# EAGLE design MDM_V3_ControlBoard_A (EAGLE 6.4)
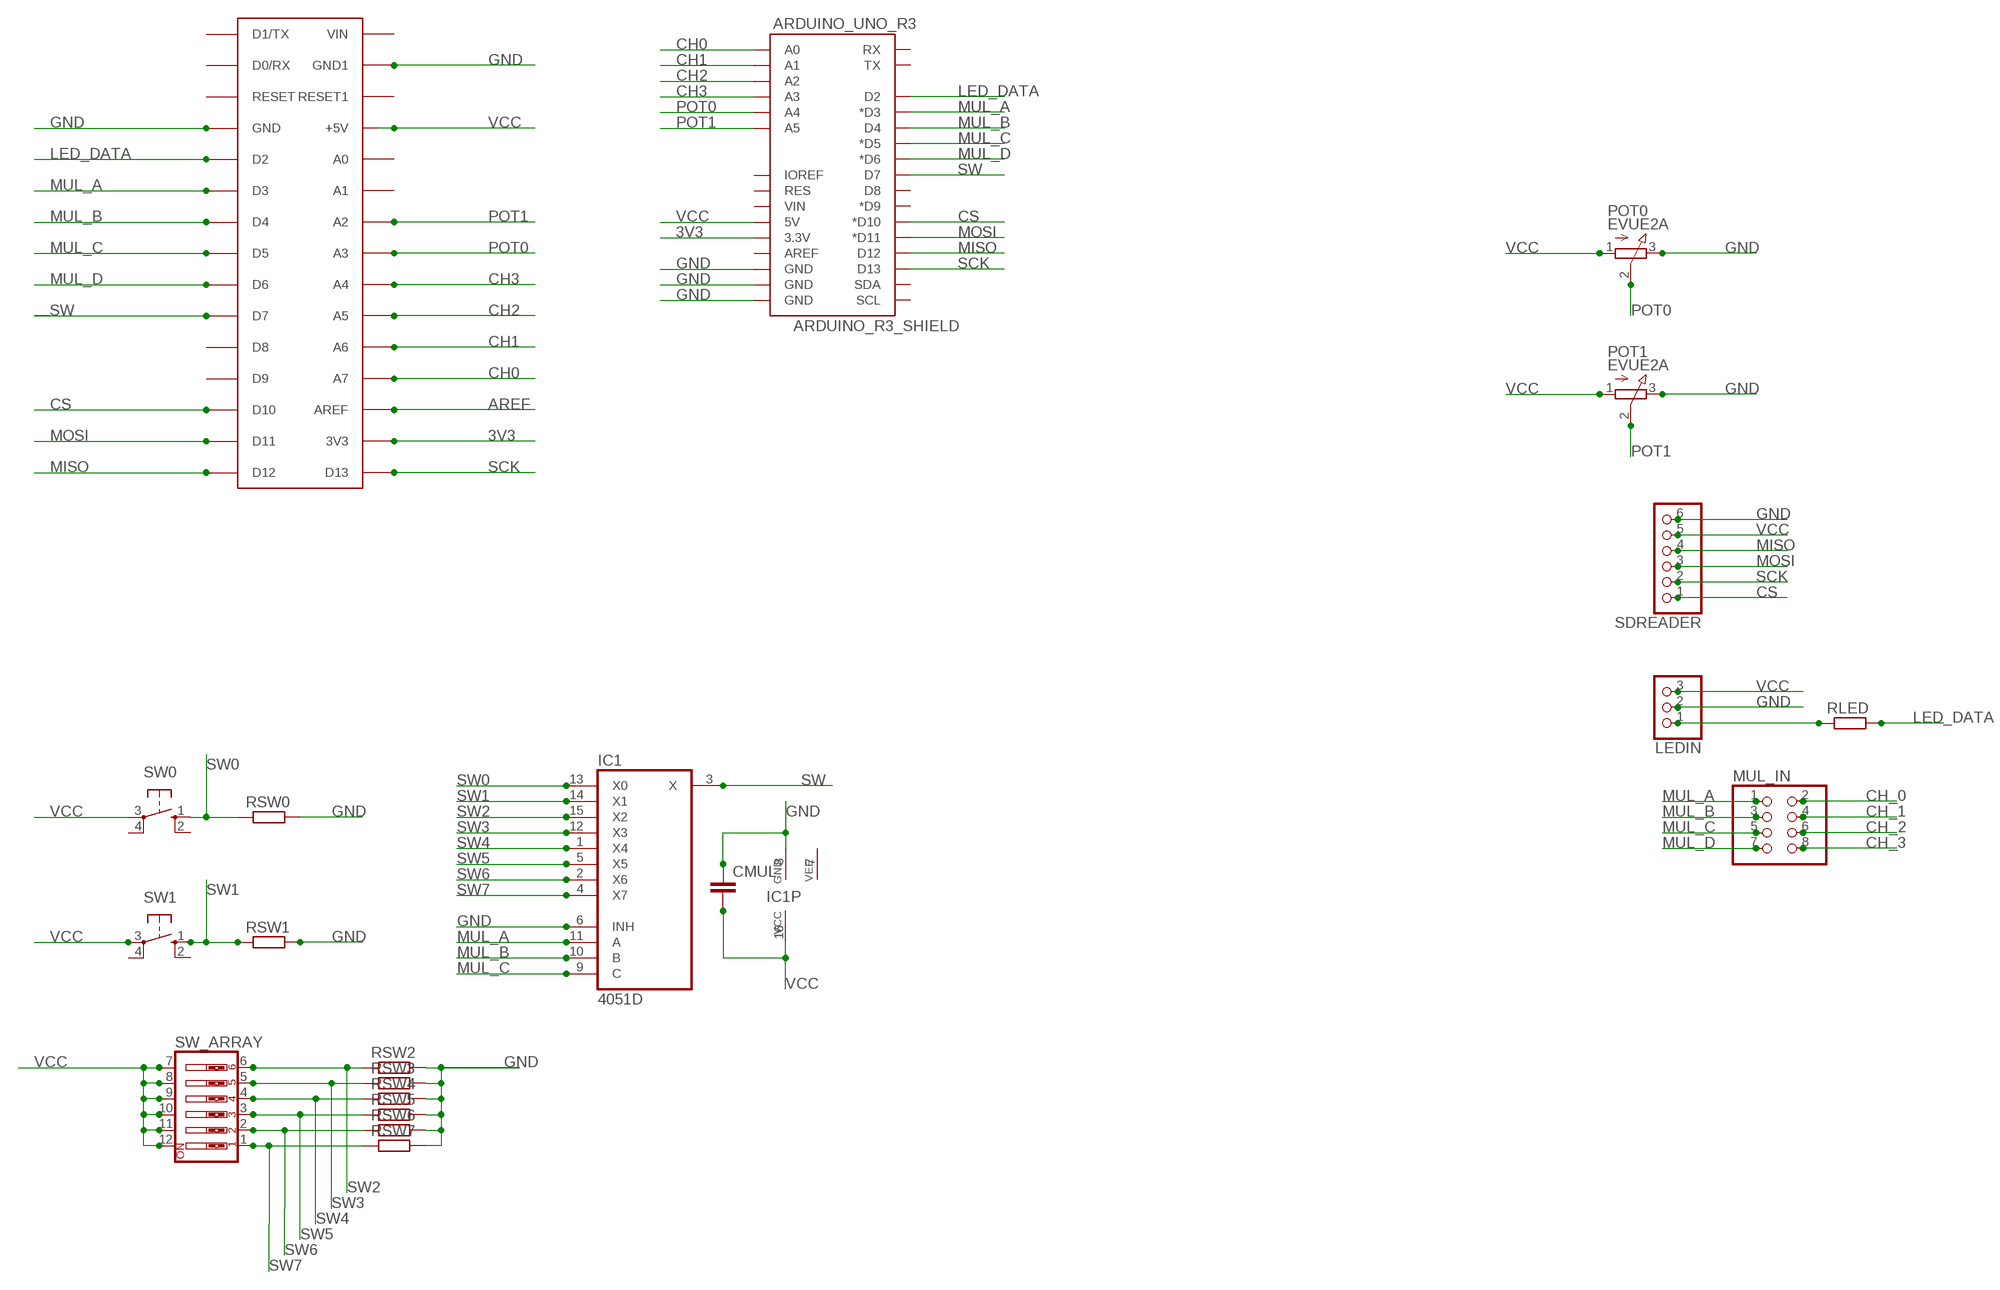
[diagram p0: schematic, sheet 1]

## Parts
ARDUINO_NANO  ARDUINONANO  [PDIP-32]
ARDUINO_UNO_R3  ARDUINO_R3_SHIELD  [UNO_R3_SHIELD]
CMUL  C-EUC1206  [C1206]
IC1  4051D  [SO16]
LEDIN  PINHD-1X3  [1X03]
MUL_IN  PINHD-2X4  [2X04]
POT0  EVUE2A  [EVUE]
POT1  EVUE2A  [EVUE]
RLED  R-EU_M1206  [M1206]
RSW0  R-EU_M1206  [M1206]
RSW1  R-EU_M1206  [M1206]
RSW2  R-EU_M1206  [M1206]
RSW3  R-EU_M1206  [M1206]
RSW4  R-EU_M1206  [M1206]
RSW5  R-EU_M1206  [M1206]
RSW6  R-EU_M1206  [M1206]
RSW7  R-EU_M1206  [M1206]
SDREADER  PINHD-1X6  [1X06]
SW0  10-XX  [B3F-10XX]
SW1  10-XX  [B3F-10XX]
SW_ARRAY  SW_DIP-6  [EDG-06]

## Nets
3V3: ARDUINO_NANO.3V3 ARDUINO_UNO_R3.3.3V
AREF: ARDUINO_NANO.AREF
CH0: ARDUINO_NANO.A7 ARDUINO_UNO_R3.A0
CH1: ARDUINO_NANO.A6 ARDUINO_UNO_R3.A1
CH2: ARDUINO_NANO.A5 ARDUINO_UNO_R3.A2
CH3: ARDUINO_NANO.A4 ARDUINO_UNO_R3.A3
CH_0: MUL_IN.2
CH_1: MUL_IN.4
CH_2: MUL_IN.6
CH_3: MUL_IN.8
CS: ARDUINO_NANO.D10 ARDUINO_UNO_R3.D10(*D10) SDREADER.1
GND [GND]: ARDUINO_NANO.GND ARDUINO_NANO.GND1 ARDUINO_UNO_R3.GND@0(GND) ARDUINO_UNO_R3.GND@1(GND) ARDUINO_UNO_R3.GND@2(GND) CMUL.1 IC1.6(INH) IC1.8(GND) LEDIN.2 POT0.3(E) POT1.3(E) RSW0.2 RSW1.2 RSW2.2 RSW3.2 RSW4.2 RSW5.2 RSW6.2 RSW7.2 SDREADER.6
LED_DATA: ARDUINO_NANO.D2 ARDUINO_UNO_R3.D2 RLED.2
MISO: ARDUINO_NANO.D12 ARDUINO_UNO_R3.D12 SDREADER.4
MOSI: ARDUINO_NANO.D11 ARDUINO_UNO_R3.D11(*D11) SDREADER.3
MUL_A: ARDUINO_NANO.D3 ARDUINO_UNO_R3.D3(*D3) IC1.11(A) MUL_IN.1
MUL_B: ARDUINO_NANO.D4 ARDUINO_UNO_R3.D4 IC1.10(B) MUL_IN.3
MUL_C: ARDUINO_NANO.D5 ARDUINO_UNO_R3.D5(*D5) IC1.9(C) MUL_IN.5
MUL_D: ARDUINO_NANO.D6 ARDUINO_UNO_R3.D6(*D6) MUL_IN.7
N$12: LEDIN.1 RLED.1
POT0: ARDUINO_NANO.A3 ARDUINO_UNO_R3.A4 POT0.2(S)
POT1: ARDUINO_NANO.A2 ARDUINO_UNO_R3.A5 POT1.2(S)
SCK: ARDUINO_NANO.D13 ARDUINO_UNO_R3.D13 SDREADER.2
SW: ARDUINO_NANO.D7 ARDUINO_UNO_R3.D7 IC1.3(X)
SW0: IC1.13(X0) RSW0.1 SW0.1(S)
SW1: IC1.14(X1) RSW1.1 SW1.1(S)
SW2: IC1.15(X2) RSW2.1 SW_ARRAY.6
SW3: IC1.12(X3) RSW3.1 SW_ARRAY.5
SW4: IC1.1(X4) RSW4.1 SW_ARRAY.4
SW5: IC1.5(X5) RSW5.1 SW_ARRAY.3
SW6: IC1.2(X6) RSW6.1 SW_ARRAY.2
SW7: IC1.4(X7) RSW7.1 SW_ARRAY.1
VCC [GND]: ARDUINO_NANO.+5V ARDUINO_UNO_R3.5V CMUL.2 IC1.16(VCC) LEDIN.3 POT0.1(A) POT1.1(A) SDREADER.5 SW0.3(P) SW1.3(P) SW_ARRAY.7 SW_ARRAY.8 SW_ARRAY.9 SW_ARRAY.10 SW_ARRAY.11 SW_ARRAY.12
Unconnected: ARDUINO_NANO.A0 ARDUINO_NANO.A1 ARDUINO_NANO.D0/RX ARDUINO_NANO.D1/TX ARDUINO_NANO.D8 ARDUINO_NANO.D9 ARDUINO_NANO.RESET ARDUINO_NANO.RESET1 ARDUINO_NANO.VIN ARDUINO_UNO_R3.AREF ARDUINO_UNO_R3.D8 ARDUINO_UNO_R3.D9(*D9) ARDUINO_UNO_R3.IOREF ARDUINO_UNO_R3.RES ARDUINO_UNO_R3.RX ARDUINO_UNO_R3.SCL ARDUINO_UNO_R3.SDA ARDUINO_UNO_R3.TX ARDUINO_UNO_R3.VIN SW0.2(S1) SW0.4(P1) SW1.2(S1) SW1.4(P1)

## Power pins joined to a net without a drawn wire
VEE: IC1.7(VEE)

## Library data of the parts
ARDUINO_NANO = jet-lib:ARDUINONANO
ARDUINO_UNO_R3 = SparkFun-Boards:ARDUINO_R3_SHIELD: Shield form compatible with the Arduino Uno R3.
CMUL = resistor:C-EU: CAPACITOR, European symbol
IC1 = 40xx:4051: 8-channel ANALOG MULTIPLEXER
LEDIN = adafruit:PINHD-1X3: PIN HEADER
MUL_IN = pinhead:PINHD-2X4: PIN HEADER
POT0 POT1 = pot:EVU: 9 mm Square Rotary Potentiometers Source: Panasonic
RLED RSW0 RSW1-RSW7 = resistor:R-EU_: RESISTOR, European symbol
SDREADER = adafruit:PINHD-1X6: PIN HEADER
SW0 SW1 = switch-omron:10-XX: OMRON SWITCH; MPN: B3F-1000; OC_FARNELL: 176432; OC_NEWARK: 36M3542
SW_ARRAY = special:SW_DIP-6: DIP SWITCH

## Net classes
1 GND: width 0.508 mm, clearance 0.254 mm

## Board
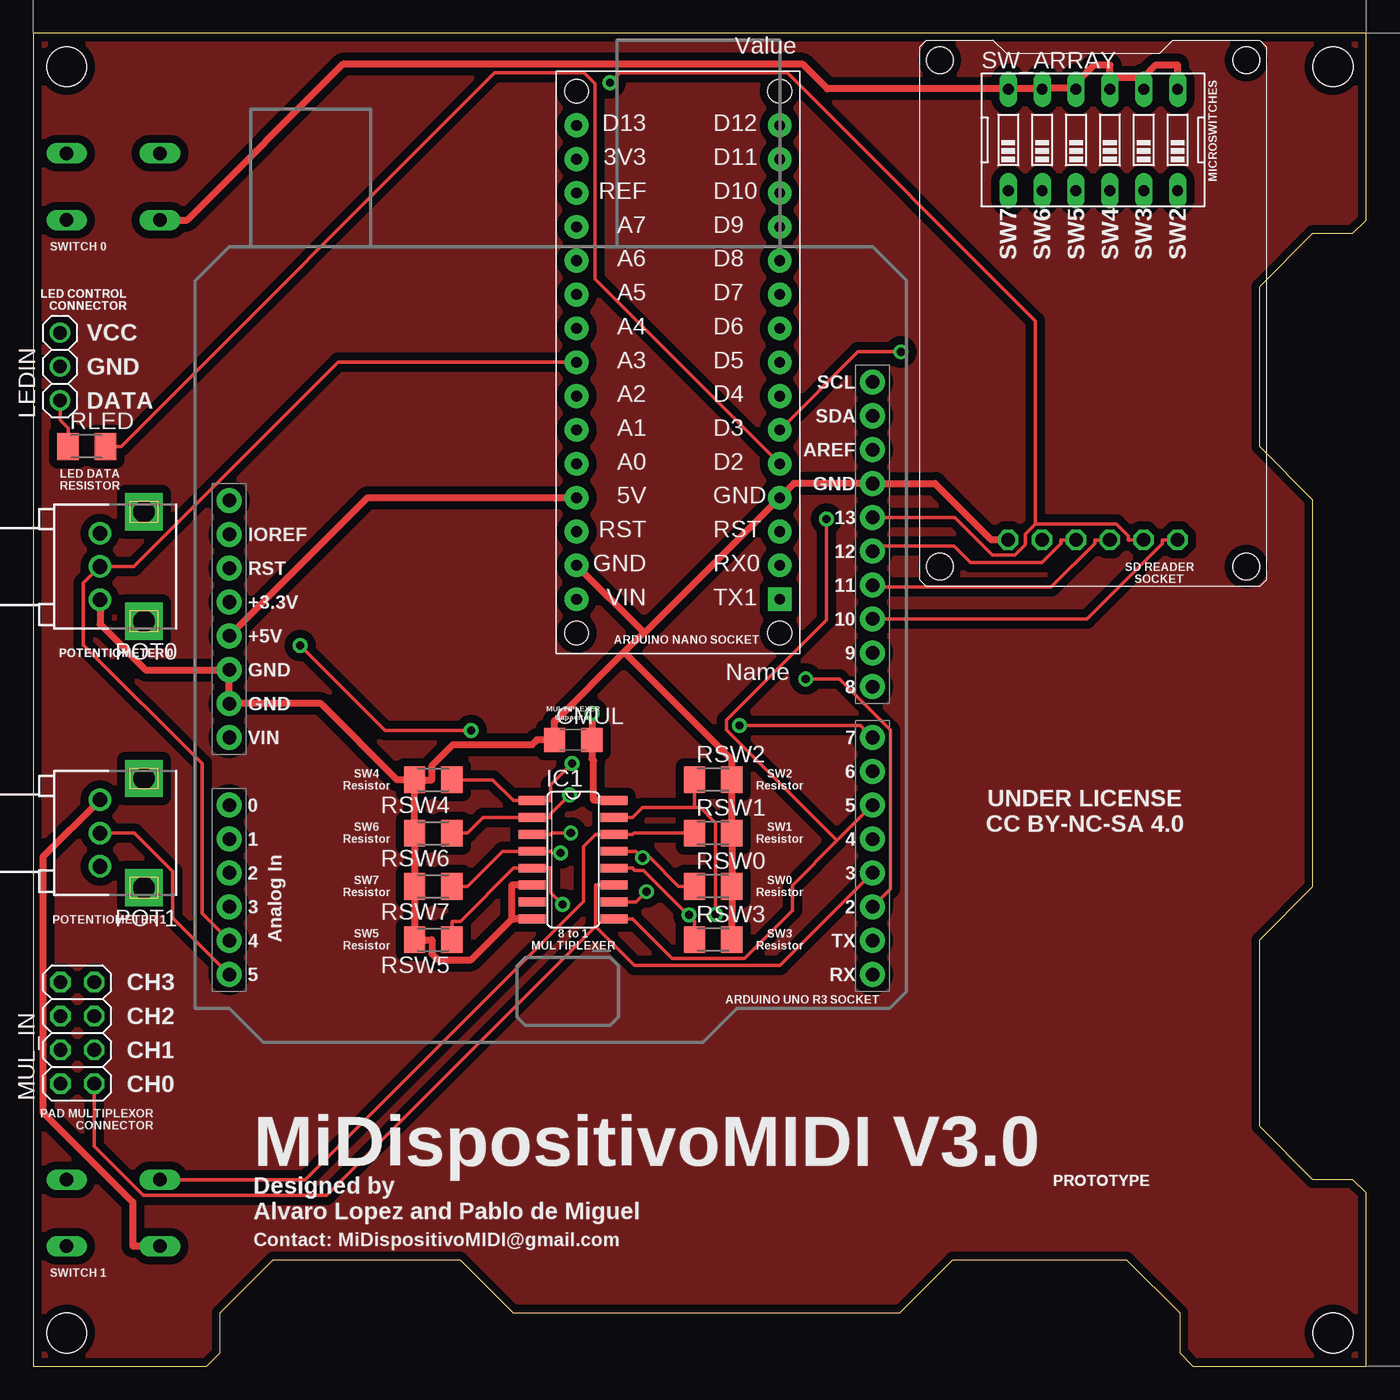
[diagram p1: board, top side]
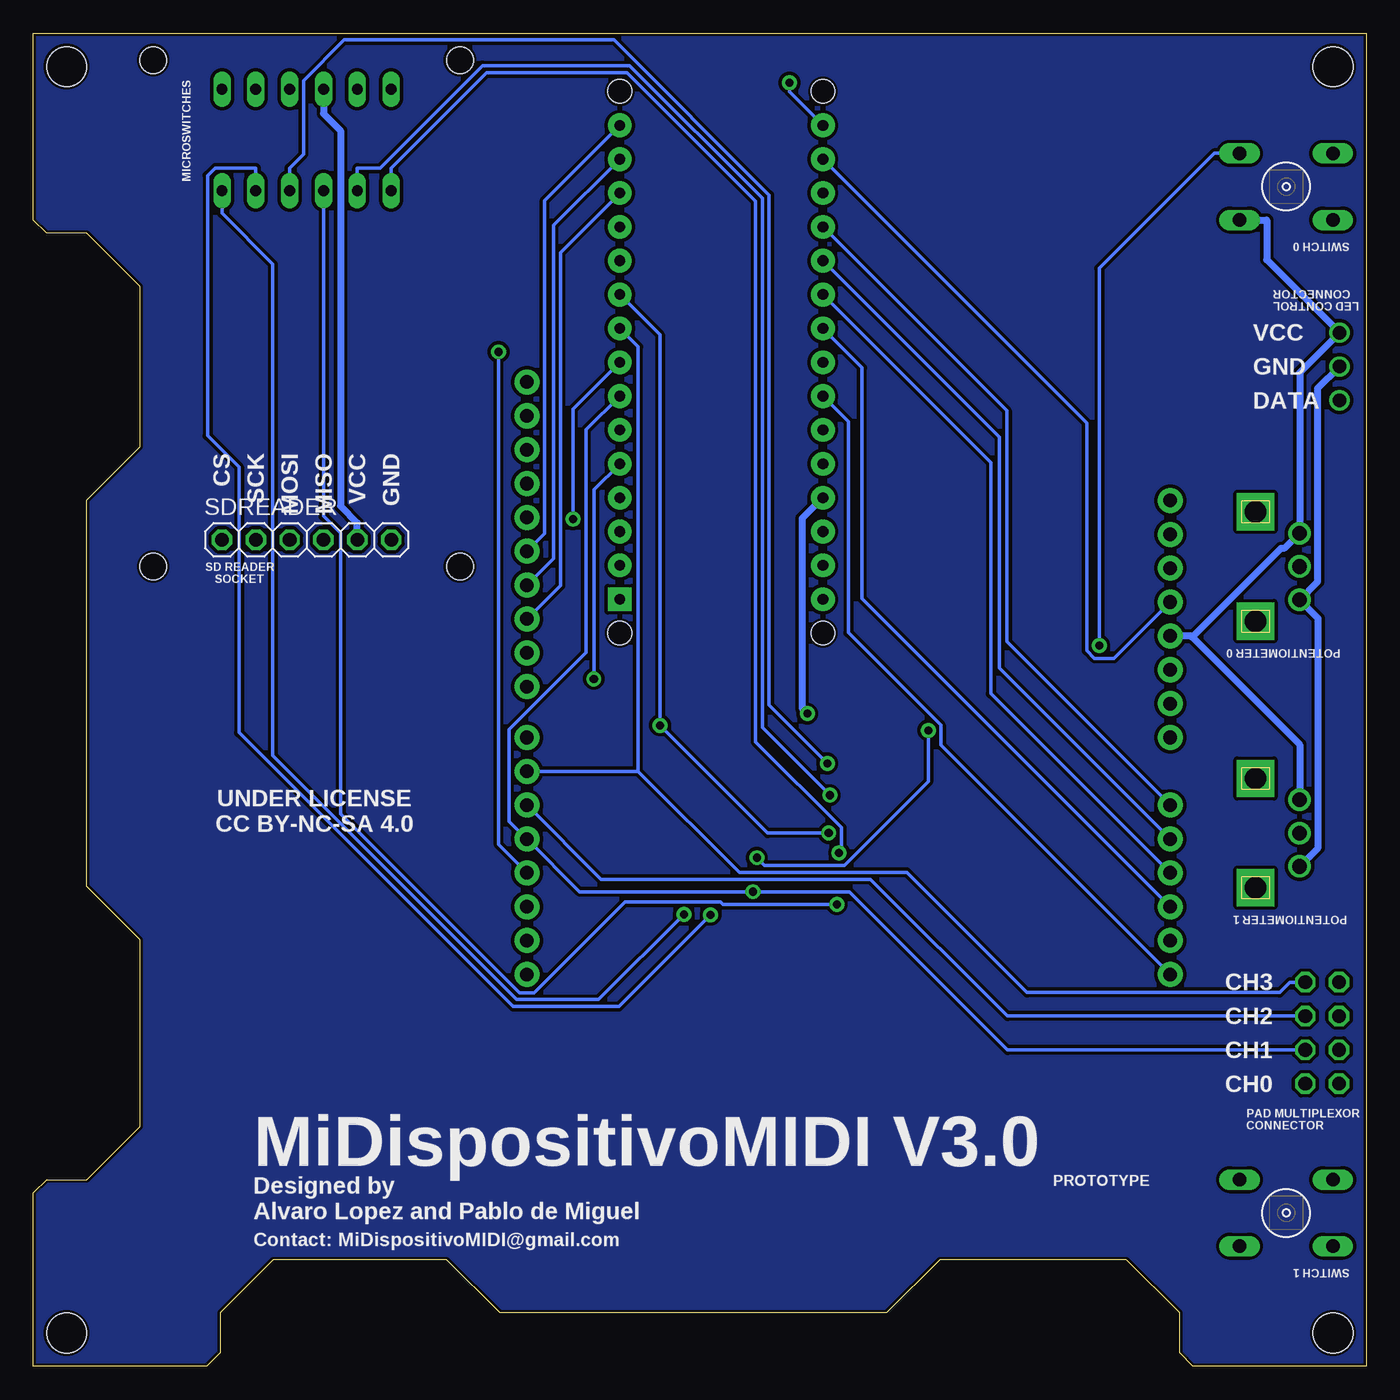
[diagram p2: board, bottom side, seen from below]

Size 100 x 100 mm. Coordinates in mm from the lower left corner, seen from the top.
Outline: 0,0 13,0 14,1 14,4 18,8 32,8 36,4 65,4 69,8 82,8 86,4 86,1 87,0 100,0 100,13 99,14 96,14 92,18 92,32 96,36 96,65 92,69 92,81 96,85 99,85 100,86 100,100 0,100 0,0
Copper layers (1*16): Top 0.035mm / dielectric 1.5mm / Bottom 0.035mm
Design rules "default *": minimum track width 10mil, minimum drill 24mil, track to track 10mil, track to pad 10mil, pad to pad 10mil, via to via 10mil, smd to smd 8mil, copper to edge 8mil, drill to drill 8mil, minimum pad ring 10mil, minimum via ring 10mil, stop-mask expansion 4mil, vias tented up to drill 0mil, thermal gap 10mil
Holes 3 mm at 2.5,97.5 2.5,2.5 97.5,2.5 97.5,97.5
Holes 2 mm at 68,98 91,98 68,60 91,60

### Footprints (pad centres in the part's own frame; a part is rotated, then mirrored left to right if it is on the bottom)
PDIP-32 = drill 0.8 pad 1.778: 3V3 15.24,-35.56; +5V 15.24,-10.16; A0 15.24,-12.7; A1 15.24,-15.24; A2 15.24,-17.78; A3 15.24,-20.32; A4 15.24,-22.86; A5 15.24,-25.4; A6 15.24,-27.94; A7 15.24,-30.48; AREF 15.24,-33.02; D0/RX 0,-5.08; D2 0,-12.7; D3 0,-15.24; D4 0,-17.78; D5 0,-20.32; D6 0,-22.86; D7 0,-25.4; D8 0,-27.94; D9 0,-30.48; D10 0,-33.02; D11 0,-35.56; D12 0,-38.1; D13 15.24,-38.1; GND 0,-10.16; GND1 15.24,-5.08; RESET 0,-7.62; RESET1 15.24,-7.62; VIN 15.24,-2.54 | drill 0.8 pad 1.778 square: D1/TX 0,-2.54 | hole 1.778: 0,0; 0,-40.64; 15.24,-40.64; 15.24,0
UNO_R3_SHIELD = drill 1.016 pad 1.88: 3.3V 50.8,26.67; 5V 50.8,29.21; A0 50.8,41.91; A1 50.8,44.45; A2 50.8,46.99; A3 50.8,49.53; A4 50.8,52.07; A5 50.8,54.61; AREF 2.54,15.24; D2 2.54,49.53; D3 2.54,46.99; D4 2.54,44.45; D5 2.54,41.91; D6 2.54,39.37; D7 2.54,36.83; D8 2.54,33.02; D9 2.54,30.48; D10 2.54,27.94; D11 2.54,25.4; D12 2.54,22.86; D13 2.54,20.32; GND@0 50.8,31.75; GND@1 50.8,34.29; GND@2 2.54,17.78; IOREF 50.8,21.59; NC 50.8,19.05; RES 50.8,24.13; RX 2.54,54.61; SCL 2.54,10.16; SDA 2.54,12.7; TX 2.54,52.07; VIN 50.8,36.83
C1206 = smd 1.6 x 1.8: 1 -1.4,0; 2 1.4,0
SO16 = smd 0.66 x 2.032: 1 -4.445,-3.073; 2 -3.175,-3.073; 3 -1.905,-3.073; 4 -0.635,-3.073; 5 0.635,-3.073; 6 1.905,-3.073; 7 3.175,-3.073; 8 4.445,-3.073; 9 4.445,3.073; 10 3.175,3.073; 11 1.905,3.073; 12 0.635,3.073; 13 -0.635,3.073; 14 -1.905,3.073; 15 -3.175,3.073; 16 -4.445,3.073
1X03 = drill 1.016: 1 -2.54,0; 2 0,0; 3 2.54,0
2X04 = drill 1.016 octagon: 1 -3.81,-1.27; 2 -3.81,1.27; 3 -1.27,-1.27; 4 -1.27,1.27; 5 1.27,-1.27; 6 1.27,1.27; 7 3.81,-1.27; 8 3.81,1.27
EVUE = drill 1.1 pad 1.676: 1 0,-2.5; 2 0,0; 3 0,2.5 | drill 1.6 pad 2.8 square: M1 -3.3,4.1; M2 -3.3,-4.1
M1206 = smd 1.6 x 2: 1 -1.4,0; 2 1.4,0
1X06 = drill 1.016 octagon: 1 -6.35,0; 2 -3.81,0; 3 -1.27,0; 4 1.27,0; 5 3.81,0; 6 6.35,0
B3F-10XX = drill 1.016 long: 1 -3.5,2.5; 2 3.5,2.5; 3 -3.5,-2.5; 4 3.5,-2.5
EDG-06 = drill 0.813 long: 1 -6.35,-3.81; 2 -3.81,-3.81; 3 -1.27,-3.81; 4 1.27,-3.81; 5 3.81,-3.81; 6 6.35,-3.81; 7 6.35,3.81; 8 3.81,3.81; 9 1.27,3.81; 10 -1.27,3.81; 11 -3.81,3.81; 12 -6.35,3.81

### Placement (x,y rotation side)
ARDUINO_NANO  56,55 180 top
ARDUINO_UNO_R3  65.5,84 180 top
CMUL  40.5,47 0 top
IC1  40.5,38 270 top
LEDIN  2,75 90 top
MUL_IN  3.3,25 90 top
POT0  5,60 180 top
POT1  5,40 180 top
RLED  4,69 0 top
RSW0  51,36 0 top
RSW1  51,40 0 top
RSW2  51,44 0 top
RSW3  51,32 0 top
RSW4  30,44 180 top
RSW5  30,32 180 top
RSW6  30,40 180 top
RSW7  30,36 180 top
SDREADER  79.5,62 0 bottom
SW0  6,88.5 0 bottom
SW1  6,11.5 0 bottom
SW_ARRAY  79.5,92 0 top

### Tracks (layer width: path | path; a pad name or v marks a point on that pad's centre or on a via)
3V3
  Bottom 0.254: ARDUINO_UNO_R3.3.3V 18.93,53.1 20.39,53.1 20.97,53.68 20.97,70.77 ARDUINO_NANO.3V3
CH0
  Bottom 0.254: ARDUINO_NANO.A7 26.97,71.69 26.97,54.36 ARDUINO_UNO_R3.A0
CH1
  Bottom 0.254: ARDUINO_NANO.A6 27.52,69.7 27.52,52.37 ARDUINO_UNO_R3.A1
CH2
  Bottom 0.254: ARDUINO_NANO.A5 28.16,67.8 28.16,50.47 ARDUINO_UNO_R3.A2
CH3
  Bottom 0.254: ARDUINO_UNO_R3.A3 37.82,57.59 37.82,74.92 ARDUINO_NANO.A4
CS
  Top 0.254: SDREADER.1 84.71,62 84.71,61.71 79.05,56.06 ARDUINO_UNO_R3.D10
  Bottom 0.254: ARDUINO_UNO_R3.D10 60.46,58.56 60.46,83.56 ARDUINO_NANO.D10
GND
  Top 0.508: 45.77,55.07 ARDUINO_NANO.GND1 | 45.77,55.07 45.91,55.07 ARDUINO_NANO.GND 57.06,66.22 ARDUINO_UNO_R3.GND@2 67.66,66.22 71.88,62 SDREADER.6 | 45.77,55.07 45.77,55 44.33,53.57 | 44.33,53.57 52.39,45.51 52.4,45.51 RSW2.2 RSW1.2 RSW0.2 52.4,33.51 RSW3.2 | 44.33,53.57 39.17,48.41 39.1,48.41 CMUL.1 37.79,47 37.43,46.64 31.48,46.64 29.91,45.06 29.91,44 RSW4.2 | RSW4.2 27.29,44 21.58,49.71 ARDUINO_UNO_R3.GND@1 ARDUINO_UNO_R3.GND@0 8.43,52.25 5,55.68 POT0.3 | IC1.6 35.9,36.09 35.9,33.55 | 35.9,33.55 36.09,33.55 IC1.8 | 35.9,33.55 32.84,30.49 30.35,30.49 29.91,30.94 29.91,32 RSW5.2 RSW7.2 RSW6.2 RSW4.2
  Bottom 0.508: LEDIN.2 3.63,73.37 3.63,58.87 POT0.3 3.6,56.1 3.6,38.9 POT1.3
LED_DATA  (via drill 0.61 pad 1.12)
  Top 0.254: v57.95,51.56 60.47,51.56 64.3,47.74 64.3,35.81 ARDUINO_UNO_R3.D2 | RLED.2 6.58,69 34.61,97.03 41.33,97.03 42.13,96.23 42.13,81.57 ARDUINO_NANO.D2
  Bottom 0.254: ARDUINO_NANO.D2 57.95,65.75 v57.95,51.56
MISO
  Top 0.254: SDREADER.4 77.09,62 77.09,61.71 75.67,60.29 70.3,60.29 69.08,61.52 63.34,61.52 ARDUINO_UNO_R3.D12
  Bottom 0.254: ARDUINO_UNO_R3.D12 61.64,62.46 61.64,87.46 ARDUINO_NANO.D12
MOSI
  Top 0.254: SDREADER.3 79.63,62 79.63,61.71 76.36,58.45 63.11,58.45 ARDUINO_UNO_R3.D11
  Bottom 0.254: ARDUINO_UNO_R3.D11 60.97,60.59 60.97,85.59 ARDUINO_NANO.D11
MUL_A  (via drill 0.61 pad 1.12)
  Top 0.254: 42.18,33 42.18,36.09 IC1.11 | ARDUINO_UNO_R3.D3 56.01,30.06 45.12,30.06 42.18,33 | MUL_IN.1 4.57,16.49 8.23,12.83 22.01,12.83 42.18,33 | v65.09,76.1 61.86,76.1 ARDUINO_NANO.D3
  Bottom 0.254: ARDUINO_UNO_R3.D3 65.09,39.14 v65.09,76.1
MUL_B  (via drill 0.61 pad 1.12)
  Top 0.254: v45.99,35.6 45.22,34.83 IC1.10
  Bottom 0.254: MUL_IN.3 26.91,23.73 38.78,35.6 v45.99,35.6 59.01,35.6 ARDUINO_UNO_R3.D4 64.29,40.88 64.29,47.78 58.53,53.55 58.53,70.25 ARDUINO_NANO.D4
MUL_C  (via drill 0.61 pad 1.12)
  Top 0.254: IC1.9 44.97,33.55 47.93,30.6 53.35,30.6 56.95,34.2 56.95,36.08 60.3,39.43 | ARDUINO_UNO_R3.D5 60.3,39.43 | 60.3,39.43 52,47.73 52,48.48 59.51,56 v59.51,63.55
  Bottom 0.254: v59.51,63.55 59.51,71.81 ARDUINO_NANO.D5 | MUL_IN.5 26.91,26.27 37.18,36.54 57.41,36.54 ARDUINO_UNO_R3.D5
MUL_D
  Bottom 0.254: 54.62,44.63 47.04,37.05 34.47,37.05 25.45,28.03 6.5,28.03 5.71,28.81 MUL_IN.7 | 54.62,44.63 54.62,76.48 ARDUINO_NANO.D6 | 54.62,44.63 ARDUINO_UNO_R3.D6
N$1
  pour Bottom: 0,100 100,100 100,86 99,85 96,85 92,81 92,69 96,65 96,36 92,32 92,18 96,14 99,14 100,13 100,0 87,0 86,1 86,4 82,8 69,8 65,4 36,4 32,8 18,8 14,4 14,1 13,0 0,0
N$2
  pour Top (isolate 0.61): 0,100 0,0 13,0 14,1 14,4 18,8 32,8 36,4 65,4 69,8 82,8 86,4 86,1 87,0 100,0 100,13 99,14 96,14 92,18 92,32 96,36 96,65 92,69 92,81 96,85 99,85 100,86 100,100
N$12
  Top 0.254: RLED.1 2.6,70.38 2,70.98 LEDIN.1
POT0
  Top 0.254: ARDUINO_UNO_R3.A4 12.65,33.98 12.65,45.22 3.75,54.12 3.75,58.75 POT0.2 7.54,60 22.86,75.32 ARDUINO_NANO.A3
POT1
  Top 0.254: POT1.2 7.56,40 10.44,37.12 10.44,33.65 ARDUINO_UNO_R3.A5
  Bottom 0.254: ARDUINO_NANO.A2 38.85,70.87 38.85,55.03 31.91,48.09 31.91,46.6 ARDUINO_UNO_R3.A5
SCK  (via drill 0.61 pad 1.12)
  Top 0.254: 75.19,63.18 74.42,62.41 74.42,61.64 73.63,60.85 71.97,60.85 69.14,63.68 ARDUINO_UNO_R3.D13 | 75.19,63.18 81.27,63.18 82.17,62.29 82.17,62 SDREADER.2 | 75.19,63.18 75.19,78.42 56.58,97.03 44.01,97.03 v43.27,96.29
  Bottom 0.254: v43.27,96.29 43.27,95.61 ARDUINO_NANO.D13
SW  (via drill 0.61 pad 1.12)
  Top 0.254: v52.98,48.08 62.05,48.08 ARDUINO_UNO_R3.D7 | IC1.3 38.82,39.91 38.92,40 v40.33,40
  Bottom 0.254: v40.33,40 44.91,40 v52.98,48.08 52.98,77.39 ARDUINO_NANO.D7
SW0  (via drill 0.61 pad 1.12)
  Top 0.254: IC1.13 45.23,38.63 v45.72,38.15 46.27,38.15 48.42,36 RSW0.1 | v20.03,54.07 26.39,47.7 v32.85,47.7
  Bottom 0.254: SW0.1 11.4,91 20.03,82.38 v20.03,54.07 | v32.85,47.7 32.85,43.85 39.14,37.56 45.13,37.56 v45.72,38.15
SW1
  Top 0.254: SW1.1 20.39,14 41.27,34.88 41.27,39 42.18,39.91 IC1.14 44.97,39.91 45.07,40 48.42,40 RSW1.1
SW2  (via drill 0.61 pad 1.12)
  Top 0.254: 49.6,41.92 45.72,41.92 44.97,41.17 IC1.15 | v51.19,33.9 51.19,40.77 50.04,41.92 49.6,41.92 | 49.6,41.92 49.6,42.62 RSW2.1
  Bottom 0.254: SW_ARRAY.6 85.85,86.49 82.04,82.68 82.04,45.81 63.74,27.51 57.58,27.51 v51.19,33.9
SW3  (via drill 0.61 pad 1.12)
  Top 0.254: 49.15,33.83 49.6,33.38 RSW3.1 | 49.15,33.83 45.77,37.21 45.12,37.21 44.97,37.37 IC1.12 | v49.18,33.87 49.15,33.83
  Bottom 0.254: SW_ARRAY.5 83.31,89.89 86.36,89.89 86.92,89.32 86.92,69.81 84.57,67.45 84.57,47.54 64,26.98 56.07,26.98 v49.18,33.87
SW4  (via drill 0.61 pad 1.12)
  Top 0.254: v40.43,45.23 38.82,43.62 38.82,42.45 IC1.1 36.03,42.45 34.47,44 RSW4.1
  Bottom 0.254: SW_ARRAY.4 80.77,89.89 79.73,90.93 79.73,96.45 76.67,99.51 56.44,99.51 44.8,87.87 44.8,49.59 v40.43,45.23
SW5  (via drill 0.61 pad 1.12)
  Top 0.254: v39.72,34.66 38.82,35.55 38.82,37.37 IC1.5 36.73,37.37 36.03,37.37 32.05,33.38 31.4,33.38 RSW5.1
  Bottom 0.254: SW_ARRAY.3 78.23,63.78 76.96,62.51 76.96,41.45 63.53,28.02 62.42,28.02 55.59,34.85 48.43,34.85 48.24,34.66 v39.72,34.66
SW6  (via drill 0.61 pad 1.12)
  Top 0.254: v40.24,42.84 38.82,41.42 38.82,41.17 IC1.2 36.03,41.17 33.76,41.17 32.58,40 RSW6.1
  Bottom 0.254: SW_ARRAY.2 75.69,89.89 73.99,89.89 66.3,97.58 55.26,97.58 45.3,87.62 45.3,47.9 v40.24,42.84
SW7  (via drill 0.61 pad 1.12)
  Top 0.254: v39.55,38.5 38.96,38.5 38.82,38.63 IC1.4 35.22,38.63 32.58,36 RSW7.1
  Bottom 0.254: SW_ARRAY.1 73.15,89.89 66,97.05 55.45,97.05 45.81,87.41 45.81,46.85 39.37,40.41 39.37,38.68 v39.55,38.5
VCC  (via drill 0.61 pad 1.12)
  Top 0.508: v41.93,48.96 41.9,48.93 CMUL.2 41.9,45.59 42.05,45.44 42.05,42.45 IC1.16 | ARDUINO_UNO_R3.5V 25.07,65.16 ARDUINO_NANO.+5V | SW1.3 7.47,9 7.47,12.3 0.72,19.05 0.72,38.22 POT1.1 | SW0.3 11.53,86 23.2,97.66 57.74,97.66 59.58,95.83 73.15,95.83 | 73.15,95.83 73.15,95.87 75.69,95.87 | SW_ARRAY.12 73.15,95.83 | 75.69,95.87 75.69,95.93 78.23,95.93 | SW_ARRAY.11 75.69,95.87 | 78.23,95.93 78.23,96.27 79.6,97.64 80.77,97.64 80.77,96.72 | SW_ARRAY.10 78.23,95.93 | SW_ARRAY.9 80.77,96.72 | 80.77,96.72 83.31,96.72 | SW_ARRAY.7 85.85,97.64 84.22,97.64 83.31,96.72 | SW_ARRAY.8 83.31,96.72
  Bottom 0.508: ARDUINO_NANO.+5V 42.31,63.6 42.31,49.35 v41.93,48.96 | SDREADER.5 75.69,63.27 76.96,64.54 76.96,92.71 78.23,93.98 SW_ARRAY.10 | 13.06,54.69 13.16,54.79 ARDUINO_UNO_R3.5V | 13.06,54.69 6.4,61.35 6.15,61.35 POT0.1 5,74.54 LEDIN.3 7.47,83.01 7.47,86 SW0.3 | 13.06,54.69 5,46.63 POT1.1

### Text on the board
_tsilk: MICROSWITCHES | SWITCH 0 | SW7 / SW6 / SW5 / SW4 / SW3 / SW2 | LED CONTROL / CONNECTOR | LED CONTROL / CONNECTOR | D13 / 3V3 / REF / A7 / A6 / A5 / A4 / A3 / A2 / A1 / A0 / 5V / RST / GND / VIN | D12 / D11 / D10 / D9 / D8 / D7 / D6 / D5 / D4 / D3 / D2 / GND / RST / RX0 / TX1 | VCC / GND / DATA | LED DATA / RESISTOR | SD READER / SOCKET | POTENTIOMETER 0 | POTENTIOMETER 0 | ARDUINO NANO SOCKET | MULTIPLEXER / Capacitor | SW4 / Resistor | SW2 / Resistor | UNDER LICENSE / CC BY-NC-SA 4.0 | SW6 / Resistor | SW1 / Resistor | SW7 / Resistor | SW0 / Resistor | POTENTIOMETER 1 | SW5 / Resistor | 8 to 1 / MULTIPLEXER | SW3 / Resistor | ARDUINO UNO R3 SOCKET | CH3 / CH2 / CH1 / CH0 | PAD MULTIPLEXOR / CONNECTOR | MiDispositivoMIDI V3.0 | PROTOTYPE | PROTOTYPE | Designed by / Alvaro Lopez and Pablo de Miguel | Contact: MiDispositivoMIDI@gmail.com | SWITCH 1 | PROTOTYPE
_bsilk: MICROSWITCHES | SWITCH 0 | LED CONTROL / CONNECTOR | VCC / GND / DATA | CS / SCK / MOSI / MISO / VCC / GND | SD READER / SOCKET | POTENTIOMETER 0 | UNDER LICENSE / CC BY-NC-SA 4.0 | POTENTIOMETER 1 | CH3 / CH2 / CH1 / CH0 | PAD MULTIPLEXOR / CONNECTOR | MiDispositivoMIDI V3.0 | PROTOTYPE | Designed by / Alvaro Lopez and Pablo de Miguel | Contact: MiDispositivoMIDI@gmail.com | SWITCH 1